# Altium project PSLink_v1.PrjPcb (part 3 of 3)
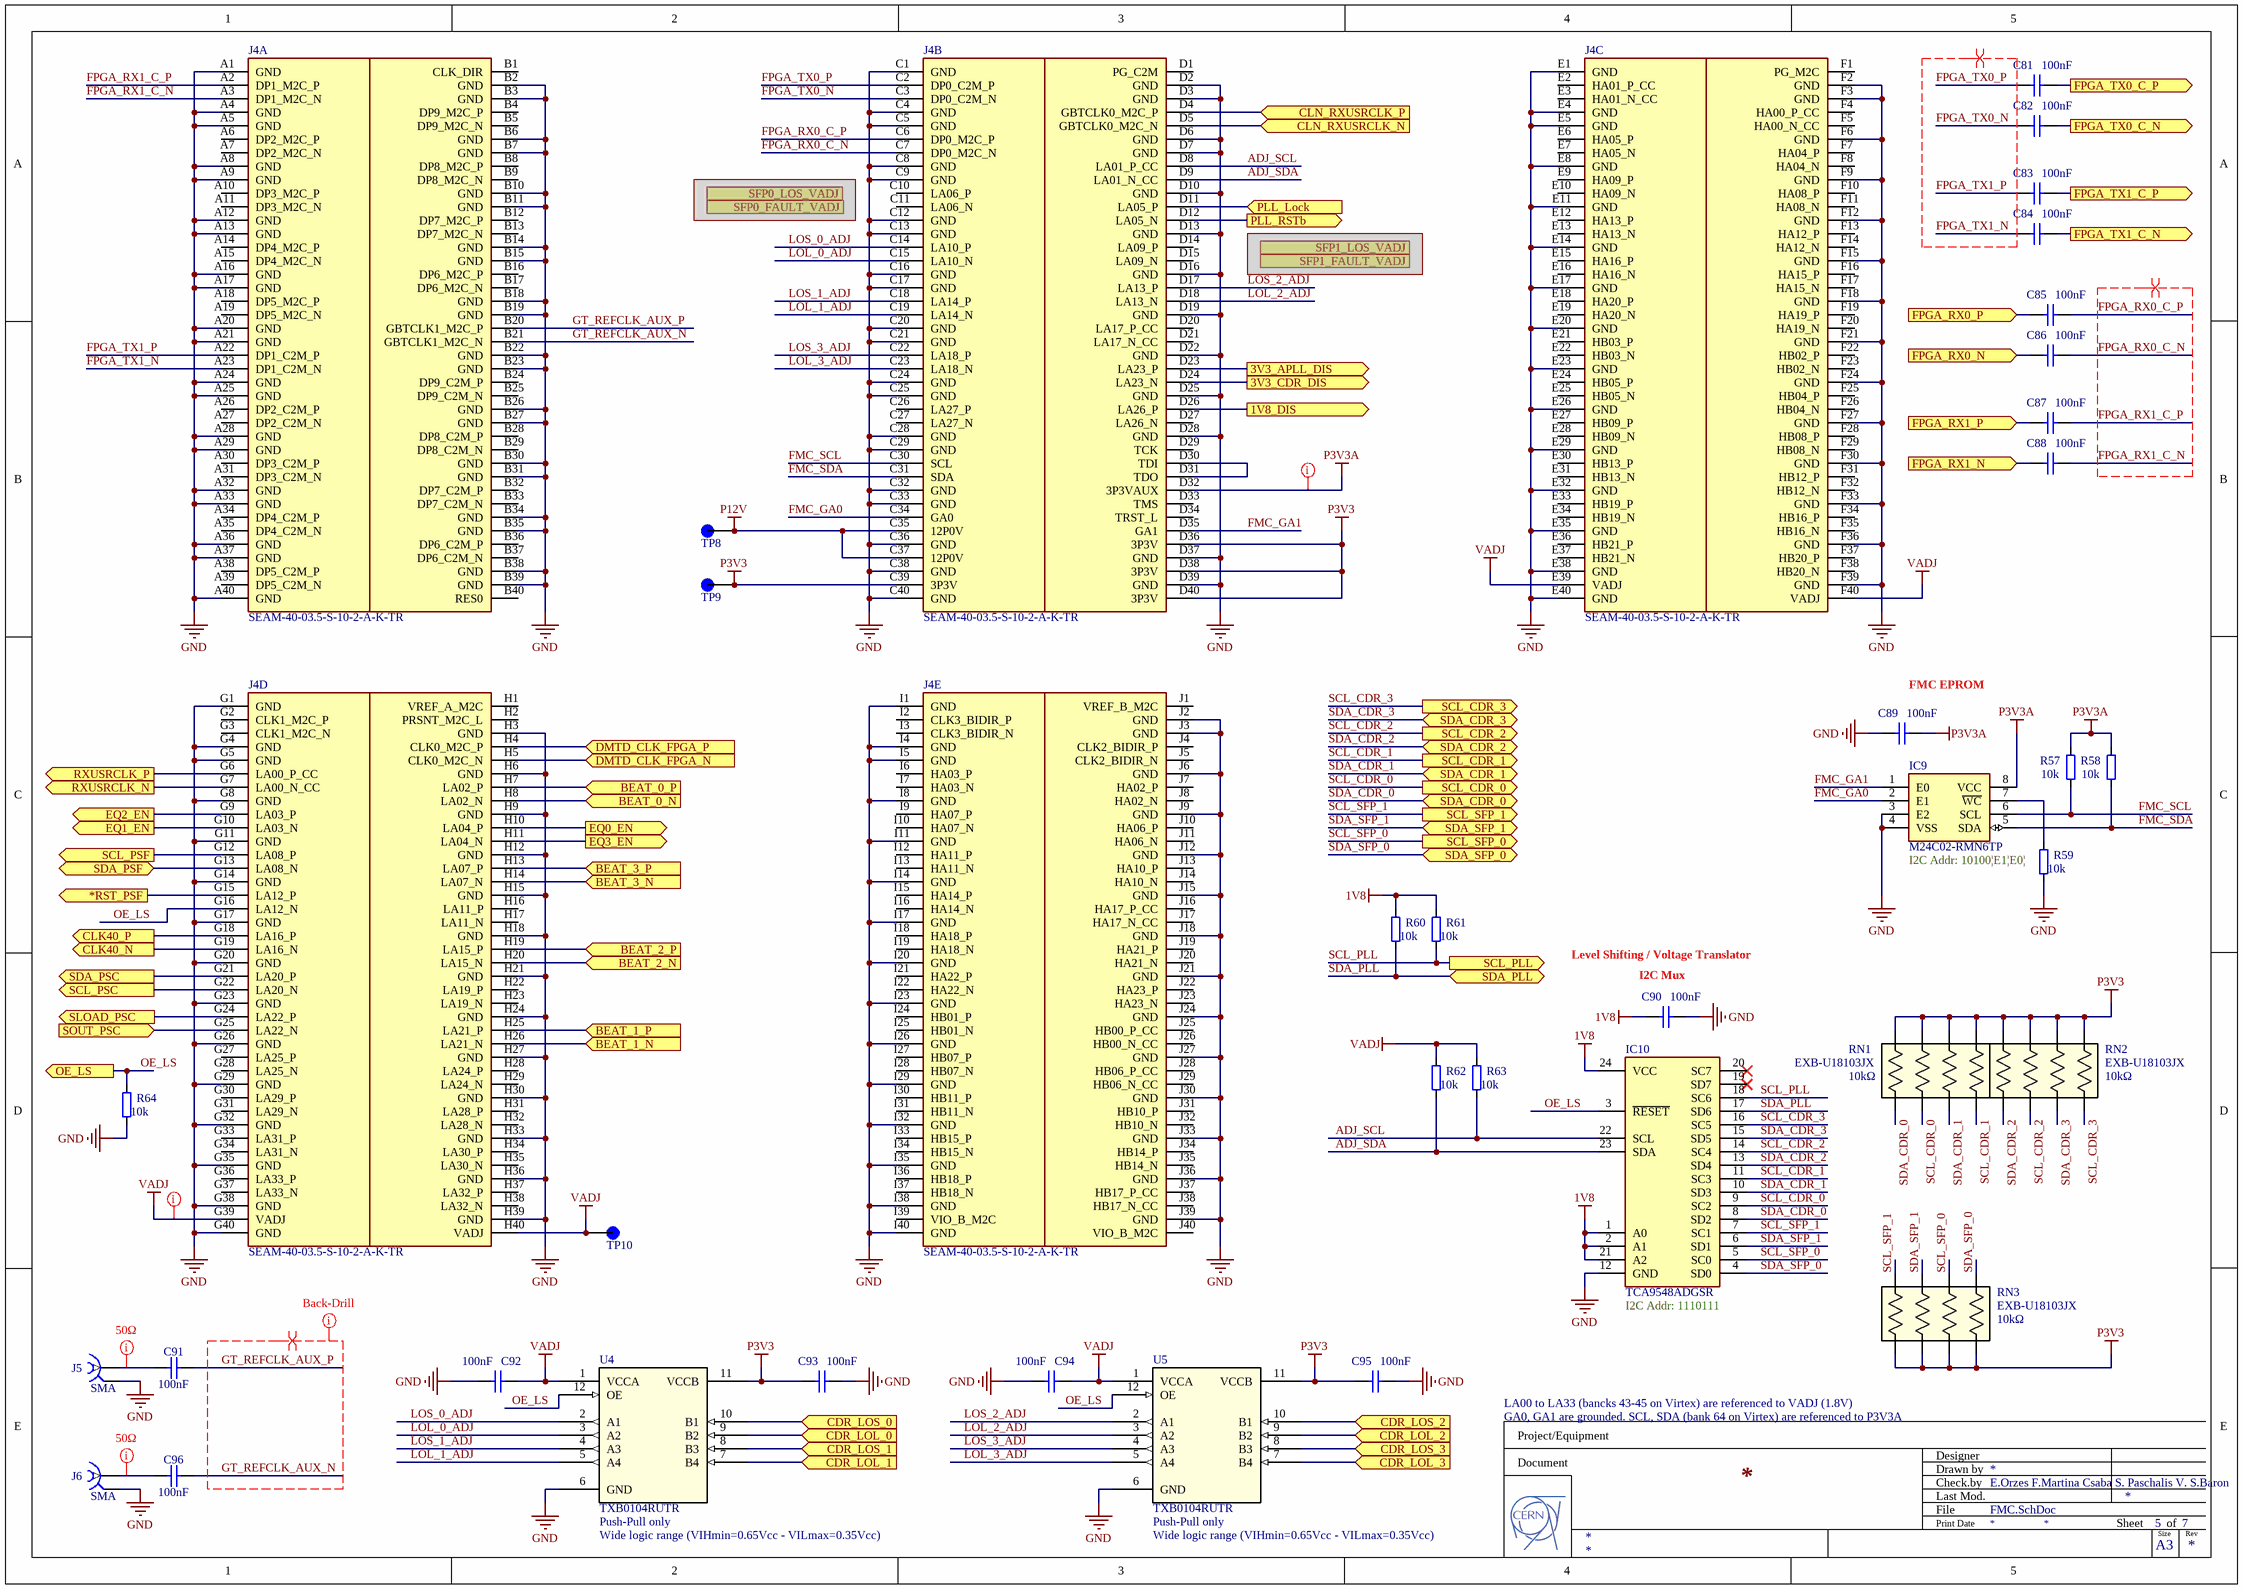
[diagram p7: FMC.SchDoc]

## Nets that join several sheets
1V8: l3 (14 pins), l2 (14 pins), l1 (14 pins), l0 (14 pins), power-sheet (6 pins), PLL (27 pins), FMC (7 pins)
1VPSF: power-sheet (6 pins), phase-shifters (13 pins)
3V3APLL: power-sheet (6 pins), PLL (C115.2 IC11.13 R72.2)
3V3CDR: l3 (22 pins), l2 (22 pins), l1 (22 pins), l0 (22 pins), power-sheet (6 pins), phase-shifters (13 pins)
GND: l3 (42 pins), l2 (42 pins), l1 (42 pins), l0 (42 pins), power-sheet (72 pins), phase-shifters (40 pins), SFP (67 pins), PLL (25 pins), FMC (174 pins)
P3V3: power-sheet (12 pins), phase-shifters (C147.2 R77.2 U7.11), SFP (8 pins), FMC (21 pins)
P12V: power-sheet (C40.1 C43.2 R13.2 U2.1), FMC (J4.C35 J4.C37 TP8.1)
VADJ: phase-shifters (8 pins), FMC (11 pins)
VREFAC: l3 (9 pins), l2 (9 pins), l1 (9 pins), l0 (9 pins), power-sheet (R25.1 R27.2)
1V8_DIS: power-sheet (Q5.1 R40.2), FMC (J4.D26)
3V3_APLL_DIS: power-sheet (Q1.1 R10.2), FMC (J4.D23)
3V3_CDR_DIS: power-sheet (Q3.1 R32.2), FMC (J4.D24)
*RST_PSF: phase-shifters (R78.2 U8.5), FMC (J4.G15)
BEAT_0_N: l0 (C24_l0.1), FMC (J4.H8)
BEAT_0_P: l0 (C12_l0.1), FMC (J4.H7)
BEAT_1_N: l1 (C24_l1.1), FMC (J4.H26)
BEAT_1_P: l1 (C12_l1.1), FMC (J4.H25)
BEAT_2_N: l2 (C24_l2.1), FMC (J4.H20)
BEAT_2_P: l2 (C12_l2.1), FMC (J4.H19)
BEAT_3_N: l3 (C24_l3.1), FMC (J4.H14)
BEAT_3_P: l3 (C12_l3.1), FMC (J4.H13)
CDR_LOL_0: l0 (IC3_l0.2 U1_l0.16), FMC (U4.9)
CDR_LOL_1: l1 (IC3_l1.2 U1_l1.16), FMC (U4.7)
CDR_LOL_2: l2 (IC3_l2.2 U1_l2.16), FMC (U5.9)
CDR_LOL_3: l3 (IC3_l3.2 U1_l3.16), FMC (U5.7)
CDR_LOS_0: l0 (IC3_l0.1 U1_l0.22), FMC (U4.10)
CDR_LOS_1: l1 (IC3_l1.1 U1_l1.22), FMC (U4.8)
CDR_LOS_2: l2 (IC3_l2.1 U1_l2.22), FMC (U5.10)
CDR_LOS_3: l3 (IC3_l3.1 U1_l3.22), FMC (U5.8)
CLK40_N: phase-shifters (IC12.3 R75.1), FMC (J4.G19)
CLK40_P: phase-shifters (IC12.2 R75.2), FMC (J4.G18)
CLN_RXUSRCLK_N: PLL (C98.2), FMC (J4.D5)
CLN_RXUSRCLK_P: PLL (C97.2), FMC (J4.D4)
DMTD_CLK_0_N: l0 (IC1_l0.7), PLL (C108.2)
DMTD_CLK_0_P: l0 (IC1_l0.6), PLL (C106.2)
DMTD_CLK_1_N: l1 (IC1_l1.7), PLL (C114.2)
DMTD_CLK_1_P: l1 (IC1_l1.6), PLL (C113.2)
DMTD_CLK_2_N: l2 (IC1_l2.7), PLL (C112.2)
DMTD_CLK_2_P: l2 (IC1_l2.6), PLL (C111.2)
DMTD_CLK_3_N: l3 (IC1_l3.7), PLL (C110.2)
DMTD_CLK_3_P: l3 (IC1_l3.6), PLL (C109.2)
DMTD_CLK_FPGA_N: PLL (C120.2), FMC (J4.H5)
DMTD_CLK_FPGA_P: PLL (C119.2), FMC (J4.H4)
EQ0_EN: l0 (IC2_l0.5), FMC (J4.H10)
EQ1_EN: l1 (IC2_l1.5), FMC (J4.G10)
EQ2_EN: l2 (IC2_l2.5), FMC (J4.G9)
EQ3_EN: l3 (IC2_l3.5), FMC (J4.H11)
FPGA_RX0_N: l0 (IC2_l0.9), FMC (C86.2)
FPGA_RX0_P: l0 (IC2_l0.10), FMC (C85.2)
FPGA_RX1_N: l2 (IC2_l2.9), FMC (C88.2)
FPGA_RX1_P: l2 (IC2_l2.10), FMC (C87.2)
FPGA_TX0_C_N: l3 (IC2_l3.4), FMC (C82.1)
FPGA_TX0_C_P: l3 (IC2_l3.1), FMC (C81.1)
FPGA_TX1_C_N: phase-shifters (U6.2), FMC (C84.1)
FPGA_TX1_C_P: phase-shifters (U6.1), FMC (C83.1)
FPGA_TX1_PS_N: l1 (IC2_l1.4), phase-shifters (ICx1.7)
FPGA_TX1_PS_P: l1 (IC2_l1.1), phase-shifters (ICx1.9)
OE_LS: phase-shifters (U7.12 U9.8), FMC (5 pins)
OE_SN74: power-sheet (IC7.4 Q4.1 R33.1), phase-shifters (C148.1 Q12.1 U8.7)
PLL_Lock: PLL (IC11.47 R73.1 TP11.1), FMC (J4.D11)
PLL_RSTb: PLL (IC11.6), FMC (J4.D12)
RXUSRCLK_N: PLL (C107.2), FMC (J4.G7)
RXUSRCLK_P: PLL (C105.2), FMC (J4.G6)
SCL0: SFP (J2.5), FMC (IC10.5 RN3#2.6)
SCL1: SFP (J3.5), FMC (IC10.7 RN3#2.8)
SCL_CDR_0: l0 (U1_l0.20), FMC (IC10.9 RN1.2)
SCL_CDR_1: l1 (U1_l1.20), FMC (IC10.11 RN1.4)
SCL_CDR_2: l2 (U1_l2.20), FMC (IC10.14 RN2.2)
SCL_CDR_3: l3 (U1_l3.20), FMC (IC10.16 RN2.4)
SCL_PLL: PLL (W5.2), FMC (IC10.18 R61.1)
SCL_PSC: phase-shifters (U7.4), FMC (J4.G22)
SCL_PSF: phase-shifters (R84.2 U9.6), FMC (J4.G12)
SDA0: SFP (J2.4), FMC (IC10.4 RN3#2.5)
SDA1: SFP (J3.4), FMC (IC10.6 RN3#2.7)
SDA_CDR_0: l0 (U1_l0.21), FMC (IC10.8 RN1.1)
SDA_CDR_1: l1 (U1_l1.21), FMC (IC10.10 RN1.3)
SDA_CDR_2: l2 (U1_l2.21), FMC (IC10.13 RN2.1)
SDA_CDR_3: l3 (U1_l3.21), FMC (IC10.15 RN2.3)
SDA_PLL: PLL (W6.2), FMC (IC10.17 R60.1)
SDA_PSC: phase-shifters (U7.3), FMC (J4.G21)
SDA_PSF: phase-shifters (R83.2 U9.5), FMC (J4.G13)
SFP_RX0_N: l0 (IC2_l0.4), SFP (J2.12)
SFP_RX0_P: l0 (IC2_l0.1), SFP (J2.13)
SFP_RX1_N: l2 (IC2_l2.4), SFP (J3.12)
SFP_RX1_P: l2 (IC2_l2.1), SFP (J3.13)
SFP_TX0_N: l3 (IC2_l3.9), SFP (J2.19)
SFP_TX0_P: l3 (IC2_l3.10), SFP (J2.18)
SFP_TX1_N: l1 (IC2_l1.9), SFP (J3.19)
SFP_TX1_P: l1 (IC2_l1.10), SFP (J3.18)
SLOAD_PSC: phase-shifters (U7.5), FMC (J4.G24)
SOUT_PSC: phase-shifters (U7.2), FMC (J4.G25)